# EAGLE board axiom_beta_power_board_v1.25 (EAGLE 7.7.0), part 1 of 4
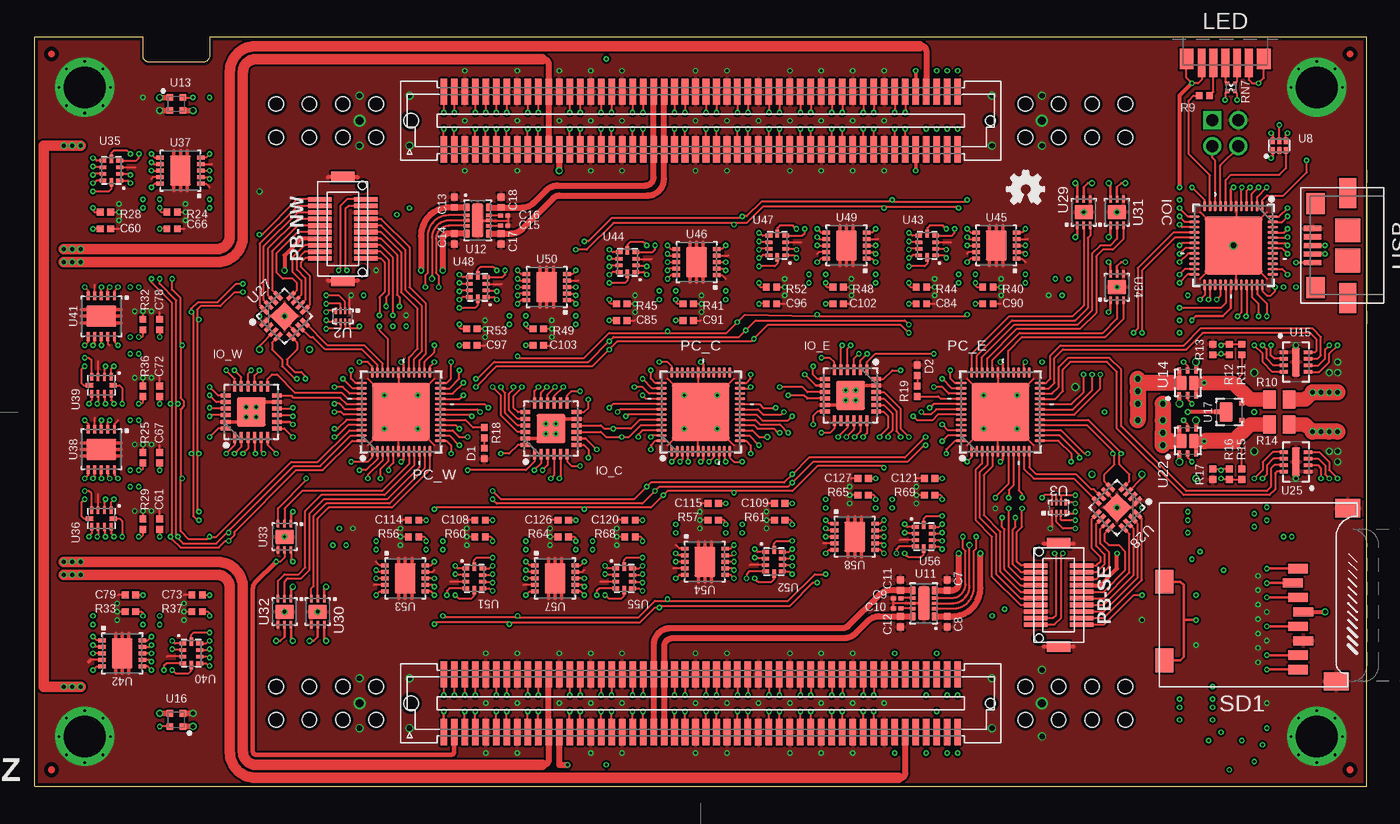
[diagram p14: board, top side]
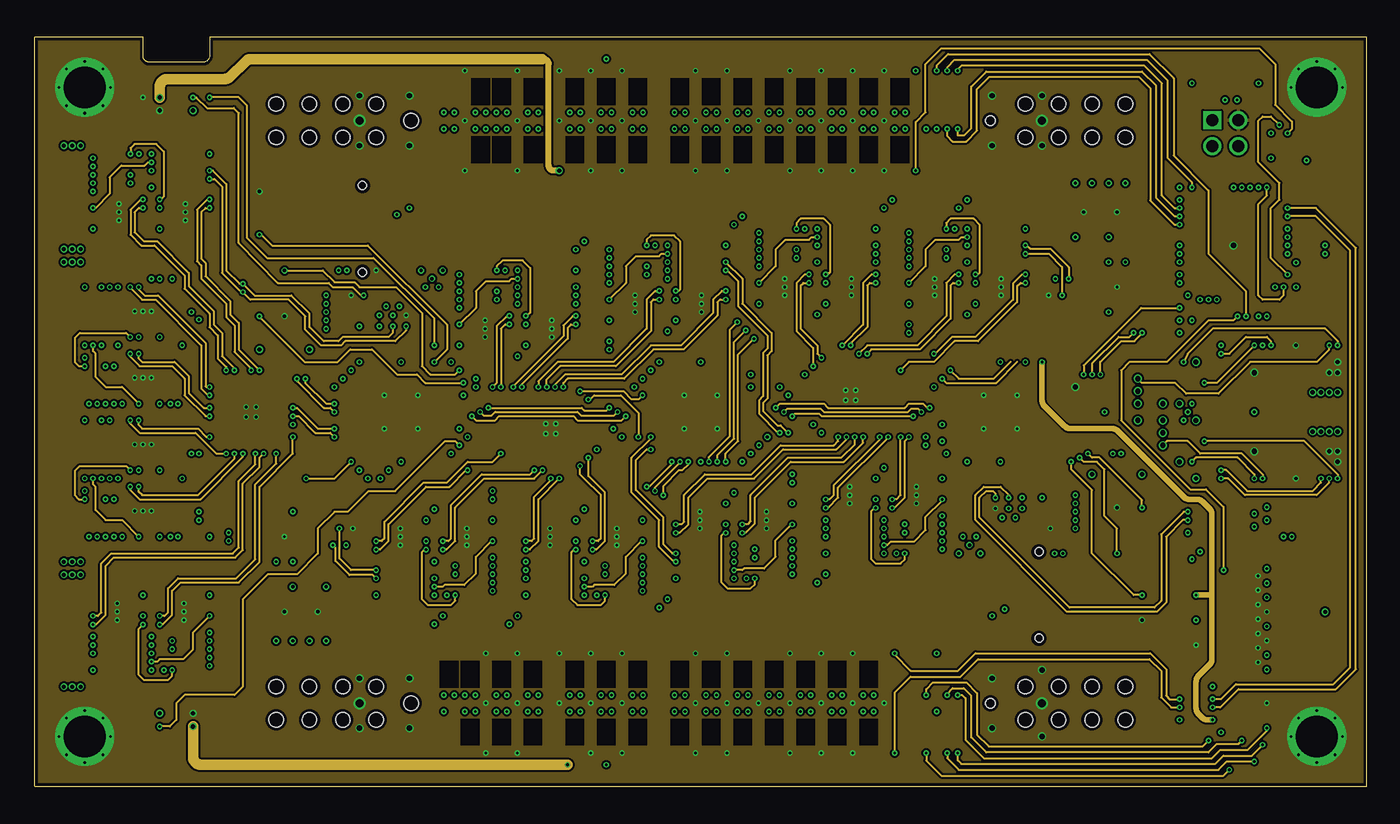
[diagram p15: board, inner layer Route2]
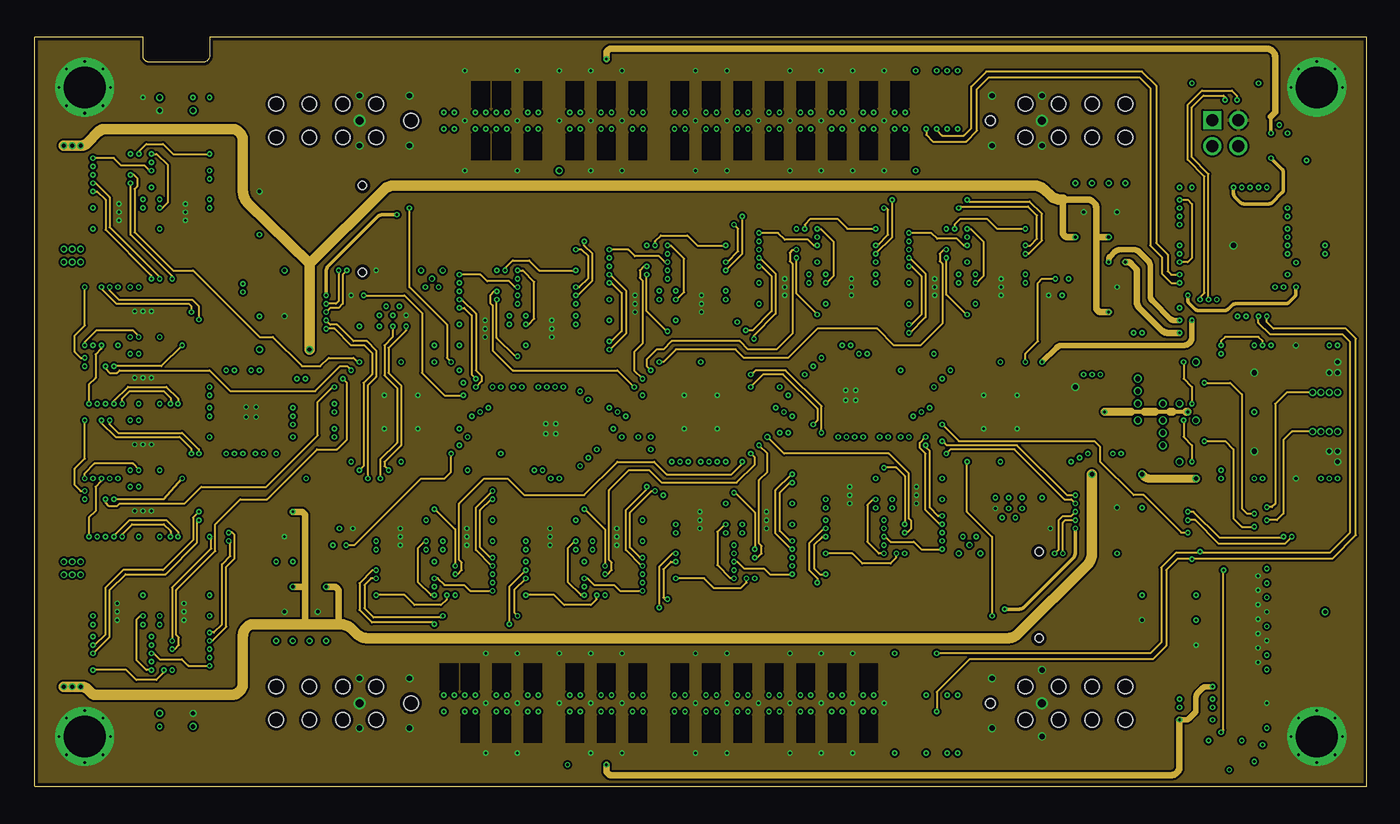
[diagram p16: board, inner layer Route15]
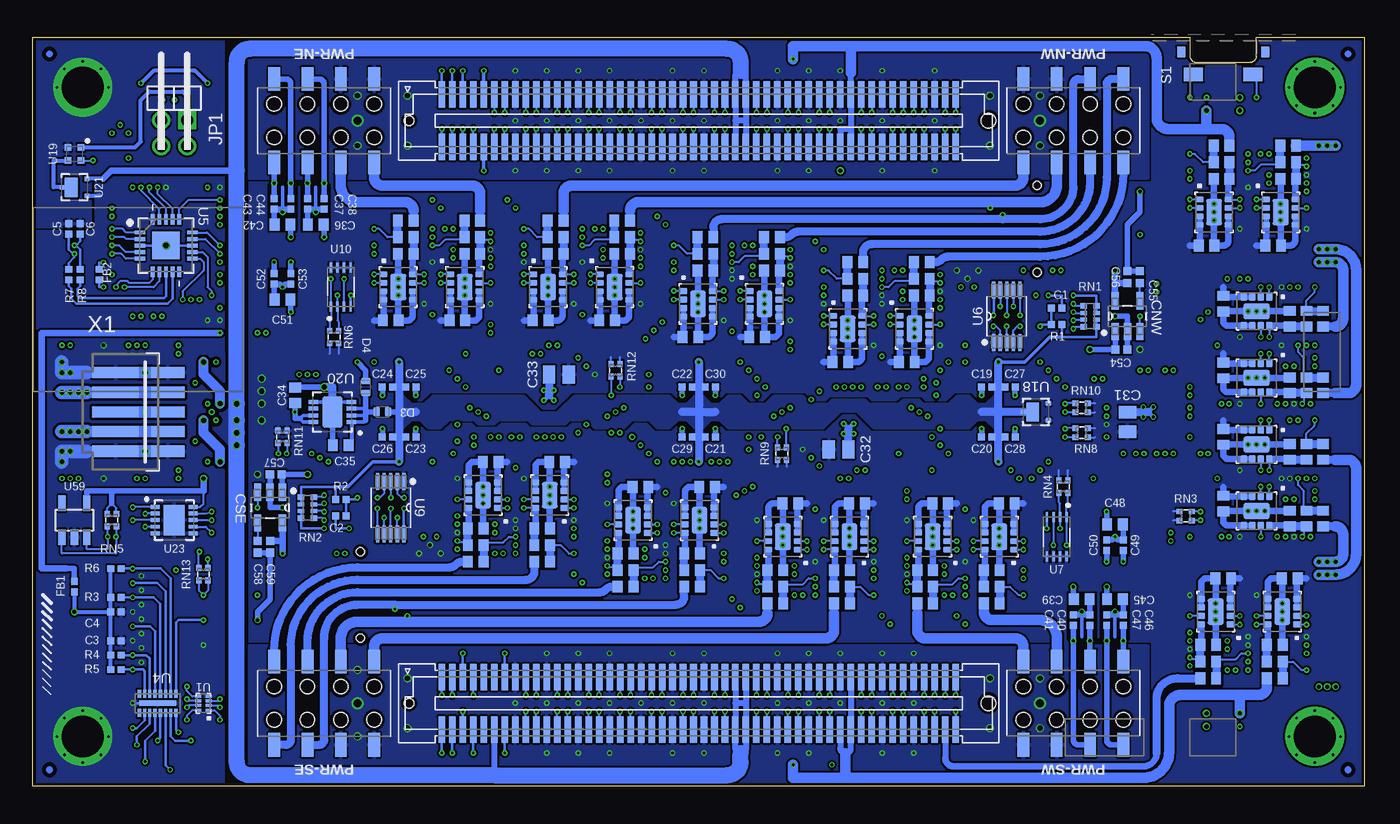
[diagram p17: board, bottom side, seen from below]

Size 101.6 x 57.15 mm. Coordinates in mm from the lower left corner, seen from the top.
Outline: 101.6,57.15 13.33,57.15 13.33,55.75 arc-90 12.83,55.25 8.76,55.25 arc-90 8.25,55.75 8.25,57.15 0,57.15 0,0 101.6,0 101.6,57.15
Copper layers (1*2*15*16): Top 0.035559375mm / dielectric 0.17018125mm / Route2 0.01778125mm / dielectric 47mil / Route15 0.01778125mm / dielectric 0.17018125mm / Bottom 0.035559375mm
Design rules "OSHPark-4layer-tuned *": minimum track width 5mil, minimum drill 8mil, track to track 6mil, track to pad 5mil, pad to pad 5mil, via to via 5mil, smd to smd 0mil, copper to edge 10mil, drill to drill 6mil, minimum pad ring 4mil, minimum via ring 4mil, stop-mask expansion 2mil, vias tented up to drill 25mil, thermal gap 6mil
Net classes: 1 LVDS: width 0.152 mm, drill 0.203 mm, clearance 0.152 mm
tKeepout: area 1.3,50.8 to 6.3,55.9; area 1.3,1.3 to 6.3,6.3; area 95.2,1.3 to 100.3,6.3; area 95.2,50.8 to 100.3,55.9
bKeepout: area 95.2,50.8 to 100.3,55.9; area 95.2,1.3 to 100.3,6.3; area 1.3,1.3 to 6.3,6.3; area 1.3,50.8 to 6.3,55.9

## Footprints (pad centres in the part's own frame; a part is rotated, then mirrored left to right if it is on the bottom)
µZ-SOCKET-NOHOLES-R = smd 0.5 x 2: 1 19.6,24.425; 2 19.6,20.027; 3 18.8,24.425; 4 18.8,20.027; 5 18,24.425; 6 18,20.027; 7 17.2,24.425; 8 17.2,20.027; 9 16.4,24.425; 10 16.4,20.027; 11 15.6,24.425; 12 15.6,20.027; 13 14.8,24.425; 14 14.8,20.027; 15 14,24.425; 16 14,20.027; 17 13.2,24.425; 18 13.2,20.027; 19 12.4,24.425; 20 12.4,20.027; 21 11.6,24.425; 22 11.6,20.027; 23 10.8,24.425; 24 10.8,20.027; 25 10,24.425; 26 10,20.027; 27 9.2,24.425; 28 9.2,20.027; 29 8.4,24.425; 30 8.4,20.027; 31 7.6,24.425; 32 7.6,20.027; 33 6.8,24.425; 34 6.8,20.027; 35 6,24.425; 36 6,20.027; 37 5.2,24.425; 38 5.2,20.027; 39 4.4,24.425; 40 4.4,20.027; 41 3.6,24.425; 42 3.6,20.027; 43 2.8,24.425; 44 2.8,20.027; 45 2,24.425; 46 2,20.027; 47 1.2,24.425; 48 1.2,20.027; 49 0.4,24.425; 50 0.4,20.027; 51 -0.4,24.425; 52 -0.4,20.027; 53 -1.2,24.425; 54 -1.2,20.027; 55 -2,24.425; 56 -2,20.027; 57 -2.8,24.425; 58 -2.8,20.027; 59 -3.6,24.425; 60 -3.6,20.027; 61 -4.4,24.425; 62 -4.4,20.027; 63 -5.2,24.425; 64 -5.2,20.027; 65 -6,24.425; 66 -6,20.027; 67 -6.8,24.425; 68 -6.8,20.027; 69 -7.6,24.425; 70 -7.6,20.027; 71 -8.4,24.425; 72 -8.4,20.027; 73 -9.2,24.425; 74 -9.2,20.027; 75 -10,24.425; 76 -10,20.027; 77 -10.8,24.425; 78 -10.8,20.027; 79 -11.6,24.425; 80 -11.6,20.027; 81 -12.4,24.425; 82 -12.4,20.027; 83 -13.2,24.425; 84 -13.2,20.027; 85 -14,24.425; 86 -14,20.027; 87 -14.8,24.425; 88 -14.8,20.027; 89 -15.6,24.425; 90 -15.6,20.027; 91 -16.4,24.425; 92 -16.4,20.027; 93 -17.2,24.425; 94 -17.2,20.027; 95 -18,24.425; 96 -18,20.027; 97 -18.8,24.425; 98 -18.8,20.027; 99 -19.6,24.425; 100 -19.6,20.027; 101 19.6,-20.025; 102 19.6,-24.425; 103 18.8,-20.027; 104 18.8,-24.425; 105 18,-20.027; 106 18,-24.425; 107 17.2,-20.027; 108 17.2,-24.425; 109 16.4,-20.027; 110 16.4,-24.425; 111 15.6,-20.027; 112 15.6,-24.425; 113 14.8,-20.027; 114 14.8,-24.425; 115 14,-20.027; 116 14,-24.425; 117 13.2,-20.027; 118 13.2,-24.425; 119 12.4,-20.027; 120 12.4,-24.425; 121 11.6,-20.027; 122 11.6,-24.425; 123 10.8,-20.027; 124 10.8,-24.425; 125 10,-20.027; 126 10,-24.425; 127 9.2,-20.027; 128 9.2,-24.425; 129 8.4,-20.027; 130 8.4,-24.425; 131 7.6,-20.027; 132 7.6,-24.425; 133 6.8,-20.027; 134 6.8,-24.425; 135 6,-20.027; 136 6,-24.425; 137 5.2,-20.027; 138 5.2,-24.425; 139 4.4,-20.027; 140 4.4,-24.425; 141 3.6,-20.027; 142 3.6,-24.425; 143 2.8,-20.027; 144 2.8,-24.425; 145 2,-20.027; 146 2,-24.425; 147 1.2,-20.027; 148 1.2,-24.425; 149 0.4,-20.027; 150 0.4,-24.425; 151 -0.4,-20.027; 152 -0.4,-24.425; 153 -1.2,-20.027; 154 -1.2,-24.425; 155 -2,-20.027; 156 -2,-24.425; 157 -2.8,-20.027; 158 -2.8,-24.425; 159 -3.6,-20.027; 160 -3.6,-24.425; 161 -4.4,-20.027; 162 -4.4,-24.425; 163 -5.2,-20.027; 164 -5.2,-24.425; 165 -6,-20.027; 166 -6,-24.425; 167 -6.8,-20.027; 168 -6.8,-24.425; 169 -7.6,-20.027; 170 -7.6,-24.425; 171 -8.4,-20.027; 172 -8.4,-24.425; 173 -9.2,-20.027; 174 -9.2,-24.425; 175 -10,-20.027; 176 -10,-24.425; 177 -10.8,-20.027; 178 -10.8,-24.425; 179 -11.6,-20.027; 180 -11.6,-24.425; 181 -12.4,-20.027; 182 -12.4,-24.425; 183 -13.2,-20.027; 184 -13.2,-24.425; 185 -14,-20.027; 186 -14,-24.425; 187 -14.8,-20.027; 188 -14.8,-24.425; 189 -15.6,-20.027; 190 -15.6,-24.425; 191 -16.4,-20.027; 192 -16.4,-24.425; 193 -17.2,-20.027; 194 -17.2,-24.425; 195 -18,-20.027; 196 -18,-24.425; 197 -18.8,-20.027; 198 -18.8,-24.425; 199 -19.6,-20.027; 200 -19.6,-24.425 | hole 0.725: 22.1,22.225; 22.1,-22.225 | hole 1.125: -22.1,22.225; -22.1,-22.225
0402-C = smd 0.52 x 0.52: 1 -0.4,0; 2 0.4,0
0201-C = smd 0.36 x 0.32: 1 -0.28,0; 2 0.28,0
0805-C = smd 0.95 x 1.35: 1 -0.75,0; 2 0.75,0
0603-C = smd 0.75 x 0.9: 1 -0.6,0; 2 0.6,0
0402-B = smd 0.62 x 0.62: 1 -0.45,0; 2 0.45,0
SOT95P280X145-5N = smd 1.321 x 0.559: 1 -1.168,0.94; 2 -1.168,0; 3 -1.168,-0.94; 4 1.168,-0.94; 5 1.168,0.94
DFN1006D-2 = smd 0.5 x 0.7: A 0.45,0; C -0.45,0
QFN50P400X400X80-25N-NSM = smd 0.813 x 0.305: 1 -1.95,1.25; 2 -1.95,0.75; 3 -1.95,0.25; 4 -1.95,-0.25; 5 -1.95,-0.75; 6 -1.95,-1.25; 13 1.95,-1.25; 14 1.95,-0.75; 15 1.95,-0.25; 16 1.95,0.25; 17 1.95,0.75; 18 1.95,1.25 | smd 0.305 x 0.813: 7 -1.25,-1.95; 8 -0.75,-1.95; 9 -0.25,-1.95; 10 0.25,-1.95; 11 0.75,-1.95; 12 1.25,-1.95; 19 1.25,1.95; 20 0.75,1.95; 21 0.25,1.95; 22 -0.25,1.95; 23 -0.75,1.95; 24 -1.25,1.95 | smd 2.2 x 2.2: 25 0,0
UQFN40P600X600X100-49N-NSM = smd 0.8 x 0.2: 1 -3,2.2; 2 -3,1.8; 3 -3,1.4; 4 -3,1; 5 -3,0.6; 6 -3,0.2; 7 -3,-0.2; 8 -3,-0.6; 9 -3,-1; 10 -3,-1.4; 11 -3,-1.8; 12 -3,-2.2; 25 3,-2.2; 26 3,-1.8; 27 3,-1.4; 28 3,-1; 29 3,-0.6; 30 3,-0.2; 31 3,0.2; 32 3,0.6; 33 3,1; 34 3,1.4; 35 3,1.8; 36 3,2.2 | smd 0.2 x 0.8: 13 -2.2,-3; 14 -1.8,-3; 15 -1.4,-3; 16 -1,-3; 17 -0.6,-3; 18 -0.2,-3; 19 0.2,-3; 20 0.6,-3; 21 1,-3; 22 1.4,-3; 23 1.8,-3; 24 2.2,-3; 37 2.2,3; 38 1.8,3; 39 1.4,3; 40 1,3; 41 0.6,3; 42 0.2,3; 43 -0.2,3; 44 -0.6,3; 45 -1,3; 46 -1.4,3; 47 -1.8,3; 48 -2.2,3 | smd 4.4 x 4.4: EP 0,0
2X02M/90-S = drill 0.914 square: 1 1,1 | drill 0.914: 2 1,-1; 3 -1,1; 4 -1,-1
MSL0104 = smd 1.06 x 1.58: 1 -2.95,-1; 7 2.95,-1 | smd 0.6 x 2.18: 2 -1.8,-1.3; 3 -0.9,-1.3; 4 0,-1.3; 5 0.9,-1.3; 6 1.8,-1.3
DF12(XX)-20DP-0.5V = smd 1.8 x 0.35: 1 -1.75,2.25; 2 1.75,2.25; 3 -1.75,1.75; 4 1.75,1.75; 5 -1.75,1.25; 6 1.75,1.25; 7 -1.75,0.75; 8 1.75,0.75; 9 -1.75,0.25; 10 1.75,0.25; 11 -1.75,-0.25; 12 1.75,-0.25; 13 -1.75,-0.75; 14 1.75,-0.75; 15 -1.75,-1.25; 16 1.75,-1.25; 17 -1.75,-1.75; 18 1.75,-1.75; 19 -1.75,-2.25; 20 1.75,-2.25 | smd 1.8 x 0.8: M1 0,3.95; M2 0,-3.95 | hole 0.625: 1.5,-3.3; 1.5,3.3
R2X04 = smd 0.9 x 1.8: 1 -3.81,3.175; 2 -3.81,-3.175; 3 -1.27,3.175; 4 -1.27,-3.175; 5 1.27,3.175; 6 1.27,-3.175; 7 3.81,3.175; 8 3.81,-3.175 | hole 1.1: -3.81,1.27; -1.27,1.27; -1.27,-1.27; -3.81,-1.27; 1.27,1.27; 1.27,-1.27; 3.81,1.27; 3.81,-1.27
4X0402ARV341 = smd 0.4 x 0.5: 1 -0.8,-0.5; 4 0.8,-0.5; 5 0.8,0.5; 8 -0.8,0.5 | smd 0.3 x 0.5: 2 -0.25,-0.5; 3 0.25,-0.5; 6 0.25,0.5; 7 -0.25,0.5
EXB24V = smd 0.4 x 0.45: 1 -0.35,-0.475; 2 0.35,-0.475; 3 0.35,0.475; 4 -0.35,0.475
EXB14V = smd 0.3 x 0.3: 1 -0.3,-0.3; 2 0.3,-0.3; 3 0.3,0.3; 4 -0.3,0.3
SKSNLAE010 = smd 1.45 x 1.05: 1 -2.275,2.575; 2 2.275,2.575 | smd 0.6 x 0.8: 3 -3.2,0.85; 4 3.2,0.85
TF-MICRO-SD_PP2 = smd 0.7 x 1.5: 1 9,-10.64; 2 7.9,-10.24; 3 6.8,-10.64; 4 5.7,-11.04; 5 4.6,-10.64; 6 3.5,-11.04; 7 2.4,-10.64; 8 1.3,-10.64 | smd 1.8 x 1.4: CD1 2,-0.44; CD2 8,-0.44 | smd 1.4 x 1.9: MT1 0.4,-13.54; MT2 13.6,-14.44
X2SON-8 = smd 0.2 x 0.52: 1 -0.525,-0.4; 2 -0.175,-0.4; 3 0.175,-0.4; 4 0.525,-0.4; 5 0.525,0.4; 6 0.175,0.4; 7 -0.175,0.4; 8 -0.525,0.4
UDFN-8 = smd 0.22 x 0.48: 1 -0.525,-0.43; 2 -0.175,-0.43; 3 0.175,-0.43; 4 0.525,-0.43; 5 0.525,0.43; 6 0.175,0.43; 7 -0.175,0.43; 8 -0.525,0.43
SON40P135X330X55-17N = smd 0.61 x 0.254: 1 -0.737,1.397; 2 -0.737,0.991; 3 -0.737,0.61; 4 -0.737,0.203; 5 -0.737,-0.203; 6 -0.737,-0.61; 7 -0.737,-0.991; 8 -0.737,-1.397; 9 0.737,-1.397; 10 0.737,-0.991; 11 0.737,-0.61; 12 0.737,-0.203; 13 0.737,0.203; 14 0.737,0.61; 15 0.737,0.991; 16 0.737,1.397 | smd 0.406 x 2.794: 17 0,0
QFN65P400X400X100-21N = smd 0.8 x 0.3: 1 -2,1; 2 -2,0.5; 3 -2,0; 4 -2,-0.5; 5 -2,-1; 11 2,-1; 12 2,-0.5; 13 2,0; 14 2,0.5; 15 2,1 | smd 0.3 x 0.8: 6 -1,-2; 7 -0.5,-2; 8 0,-2; 9 0.5,-2; 10 1,-2; 16 1,2; 17 0.5,2; 18 0,2; 19 -0.5,2; 20 -1,2 | smd 2.1 x 2.1: EP 0,0
SOP50P490X110-10N = smd 1.3 x 0.32: 1 -2,1; 2 -2,0.5; 3 -2,0; 4 -2,-0.5; 5 -2,-1; 6 2,-1; 7 2,-0.5; 8 2,0; 9 2,0.5; 10 2,1
SOT996-2/3 = smd 0.25 x 0.75: 1 -0.75,-1.5; 2 -0.25,-1.5; 3 0.25,-1.5; 4 0.75,-1.5; 5 0.75,1.5; 6 0.25,1.5; 7 -0.25,1.5; 8 -0.75,1.5
MICROPAK-6 = smd 0.3 x 0.5: 1 -0.5,-0.375; 2 0,-0.375; 3 0.5,-0.375; 4 0.5,0.375; 5 0,0.375; 6 -0.5,0.375
V-DFN3020-14 = smd 0.65 x 0.5: 1 -1,-0.85; 5 1,-0.85; 6 1,0.85; 10 -1,0.85 | smd 0.25 x 0.5: 2 -0.4,-0.85; 3 0,-0.85; 4 0.4,-0.85; 7 0.4,0.85; 8 0,0.85; 9 -0.4,0.85 | smd 2.55 x 0.9: EP 0,0
MLF-4 = smd 0.5 x 0.5: 1 -0.5,-0.5; 2 0.5,-0.5; 3 0.5,0.5; 4 -0.5,0.5
UDFN6 = smd 0.47 x 0.35: 1 -0.95,0.65; 2 -0.95,0; 3 -0.95,-0.65; 4 0.95,-0.65; 5 0.95,0; 6 0.95,0.65 | smd 1.1 x 0.75: D1 0,0.46; D2 0,-0.46
DFN8 = smd 0.25 x 0.7: 1 -0.75,-0.925; 2 -0.25,-0.925; 3 0.25,-0.925; 4 0.75,-0.925; 5 0.75,0.925; 6 0.25,0.925; 7 -0.25,0.925; 8 -0.75,0.925 | smd 2.2 x 0.6: EP 0,0
DFN2020D-3 = smd 0.45 x 0.35: 1 -0.95,0.65; 2 -0.95,-0.65; 3 0.95,0 | smd 1 x 1.5: 4 0.25,0
DFN3X3_8LEAD = smd 0.813 x 0.305: 1 -1.448,0.762; 2 -1.448,0.254; 3 -1.448,-0.254; 4 -1.448,-0.762; 5 1.448,-0.762; 6 1.448,-0.254; 7 1.448,0.254; 8 1.448,0.762 | smd 1.549 x 2.388: 9 0,0
DFN3X3_10LEAD = smd 0.7 x 0.3: 1 -1.45,1; 2 -1.45,0.5; 3 -1.45,0; 4 -1.45,-0.5; 5 -1.45,-1; 6 1.45,-1; 7 1.45,-0.5; 8 1.45,0; 9 1.45,0.5; 10 1.45,1 | smd 1.6 x 2.3: EPAD 0,0
QFN50P300X300X80-17N = smd 0.8 x 0.3: 1 -1.45,0.75; 2 -1.45,0.25; 3 -1.45,-0.25; 4 -1.45,-0.75; 9 1.45,-0.75; 10 1.45,-0.25; 11 1.45,0.25; 12 1.45,0.75 | smd 0.3 x 0.8: 5 -0.75,-1.45; 6 -0.25,-1.45; 7 0.25,-1.45; 8 0.75,-1.45; 13 0.75,1.45; 14 0.25,1.45; 15 -0.25,1.45; 16 -0.75,1.45 | smd 1.55 x 1.55: EP 0,0
DFN2018-6 = smd 0.25 x 0.55: 1 -0.5,-1; 2 0,-1; 3 0.5,-1; 4 0.5,1; 5 0,1; 6 -0.5,1 | smd 1.4 x 1.1: 10 0,0
X2QFN-10 = smd 0.3 x 0.58: 1 -0.75,-0.64; 4 0.75,-0.64; 6 0.75,0.64; 9 -0.75,0.64 | smd 0.25 x 0.58: 2 -0.25,-0.64; 3 0.25,-0.64; 7 0.25,0.64; 8 -0.25,0.64 | smd 0.64 x 0.35: 5 0.9,0; 10 -0.9,0
DFN-10 = smd 0.3 x 0.65: 1 -1,-1.55; 2 -0.5,-1.55; 3 0,-1.55; 4 0.5,-1.55; 5 1,-1.55; 6 1,1.55; 7 0.5,1.55; 8 0,1.55; 9 -0.5,1.55; 10 -1,1.55 | smd 2.3 x 1.6: EP 0,0
SOT23-5L = smd 0.55 x 1.2: 1 -0.95,-1.3; 2 0,-1.3; 3 0.95,-1.3; 4 0.95,1.3; 5 -0.95,1.3
MICROSIP = smd 0.48 x 0.58: 1 -0.975,-1.1; 2 -0.325,-1.1; 3 0.325,-1.1; 4 0.975,-1.1; 5 0.975,1.1; 6 0.325,1.1; 7 -0.325,1.1; 8 -0.975,1.1 | smd 2 x 1.2: EP 0,0
MICROSIP-DD = smd 0.48 x 0.58: 1 -0.975,-1.1; 2 -0.325,-1.1; 3 0.325,-1.1; 4 0.975,-1.1; 5 0.975,1.1; 6 0.325,1.1; 7 -0.325,1.1; 8 -0.975,1.1 | smd 2 x 1.2: EP 0,0
MICRO-AB-H-SMT = smd 0.4 x 1.35: 1 -1.3,4.125; 2 -0.65,4.125; 3 0,4.125; 4 0.65,4.125; 5 1.3,4.125 | smd 2.3 x 1.3: Z1 -4,1.45; Z4 4,1.45 | smd 1.8 x 1.9: Z2 -1.15,1.45; Z3 1.15,1.45 | smd 1.6 x 1.4: Z5 -3.2,3.9; Z6 3.2,3.9
PICO-SPOX-5 = smd 0.85 x 2.55: 1 -3,-6.5; 2 -1.5,-6.5; 3 0,-6.5; 4 1.5,-6.5; 5 3,-6.5 | smd 0.85 x 3.55: 1A -3,-2.5; 2A -1.5,-2.5; 3A 0,-2.5; 4A 1.5,-2.5; 5A 3,-2.5
µZ-CONONLY = smd 0.5 x 2: 1 19.6,-24.226; 2 19.6,-20.226; 3 18.8,-24.226; 4 18.8,-20.226; 5 18,-24.226; 6 18,-20.226; 7 17.2,-24.226; 8 17.2,-20.226; 9 16.4,-24.226; 10 16.4,-20.226; 11 15.6,-24.226; 12 15.6,-20.226; 13 14.8,-24.226; 14 14.8,-20.226; 15 14,-24.226; 16 14,-20.226; 17 13.2,-24.226; 18 13.2,-20.226; 19 12.4,-24.226; 20 12.4,-20.226; 21 11.6,-24.226; 22 11.6,-20.226; 23 10.8,-24.226; 24 10.8,-20.226; 25 10,-24.226; 26 10,-20.226; 27 9.2,-24.226; 28 9.2,-20.226; 29 8.4,-24.226; 30 8.4,-20.226; 31 7.6,-24.226; 32 7.6,-20.226; 33 6.8,-24.226; 34 6.8,-20.226; 35 6,-24.226; 36 6,-20.226; 37 5.2,-24.226; 38 5.2,-20.226; 39 4.4,-24.226; 40 4.4,-20.226; 41 3.6,-24.226; 42 3.6,-20.226; 43 2.8,-24.226; 44 2.8,-20.226; 45 2,-24.226; 46 2,-20.226; 47 1.2,-24.226; 48 1.2,-20.226; 49 0.4,-24.226; 50 0.4,-20.226; 51 -0.4,-24.226; 52 -0.4,-20.226; 53 -1.2,-24.226; 54 -1.2,-20.226; 55 -2,-24.226; 56 -2,-20.226; 57 -2.8,-24.226; 58 -2.8,-20.226; 59 -3.6,-24.226; 60 -3.6,-20.226; 61 -4.4,-24.226; 62 -4.4,-20.226; 63 -5.2,-24.226; 64 -5.2,-20.226; 65 -6,-24.226; 66 -6,-20.226; 67 -6.8,-24.226; 68 -6.8,-20.226; 69 -7.6,-24.226; 70 -7.6,-20.226; 71 -8.4,-24.226; 72 -8.4,-20.226; 73 -9.2,-24.226; 74 -9.2,-20.226; 75 -10,-24.226; 76 -10,-20.226; 77 -10.8,-24.226; 78 -10.8,-20.226; 79 -11.6,-24.226; 80 -11.6,-20.226; 81 -12.4,-24.226; 82 -12.4,-20.226; 83 -13.2,-24.226; 84 -13.2,-20.226; 85 -14,-24.226; 86 -14,-20.226; 87 -14.8,-24.226; 88 -14.8,-20.226; 89 -15.6,-24.226; 90 -15.6,-20.226; 91 -16.4,-24.226; 92 -16.4,-20.226; 93 -17.2,-24.226; 94 -17.2,-20.226; 95 -18,-24.226; 96 -18,-20.226; 97 -18.8,-24.226; 98 -18.8,-20.226; 99 -19.6,-24.226; 100 -19.6,-20.226; 101 19.6,20.226; 102 19.6,24.226; 103 18.8,20.226; 104 18.8,24.226; 105 18,20.226; 106 18,24.226; 107 17.2,20.226; 108 17.2,24.226; 109 16.4,20.226; 110 16.4,24.226; 111 15.6,20.226; 112 15.6,24.226; 113 14.8,20.226; 114 14.8,24.226; 115 14,20.226; 116 14,24.226; 117 13.2,20.226; 118 13.2,24.226; 119 12.4,20.226; 120 12.4,24.226; 121 11.6,20.226; 122 11.6,24.226; 123 10.8,20.226; 124 10.8,24.226; 125 10,20.226; 126 10,24.226; 127 9.2,20.226; 128 9.2,24.226; 129 8.4,20.226; 130 8.4,24.226; 131 7.6,20.226; 132 7.6,24.226; 133 6.8,20.226; 134 6.8,24.226; 135 6,20.226; 136 6,24.226; 137 5.2,20.226; 138 5.2,24.226; 139 4.4,20.226; 140 4.4,24.226; 141 3.6,20.226; 142 3.6,24.226; 143 2.8,20.226; 144 2.8,24.226; 145 2,20.226; 146 2,24.226; 147 1.2,20.226; 148 1.2,24.226; 149 0.4,20.226; 150 0.4,24.226; 151 -0.4,20.226; 152 -0.4,24.226; 153 -1.2,20.226; 154 -1.2,24.226; 155 -2,20.226; 156 -2,24.226; 157 -2.8,20.226; 158 -2.8,24.226; 159 -3.6,20.226; 160 -3.6,24.226; 161 -4.4,20.226; 162 -4.4,24.226; 163 -5.2,20.226; 164 -5.2,24.226; 165 -6,20.226; 166 -6,24.226; 167 -6.8,20.226; 168 -6.8,24.226; 169 -7.6,20.226; 170 -7.6,24.226; 171 -8.4,20.226; 172 -8.4,24.226; 173 -9.2,20.226; 174 -9.2,24.226; 175 -10,20.226; 176 -10,24.226; 177 -10.8,20.226; 178 -10.8,24.226; 179 -11.6,20.226; 180 -11.6,24.226; 181 -12.4,20.226; 182 -12.4,24.226; 183 -13.2,20.226; 184 -13.2,24.226; 185 -14,20.226; 186 -14,24.226; 187 -14.8,20.226; 188 -14.8,24.226; 189 -15.6,20.226; 190 -15.6,24.226; 191 -16.4,20.226; 192 -16.4,24.226; 193 -17.2,20.226; 194 -17.2,24.226; 195 -18,20.226; 196 -18,24.226; 197 -18.8,20.226; 198 -18.8,24.226; 199 -19.6,20.226; 200 -19.6,24.226 | hole 1.125: -22.1,-22.225; -22.1,22.225 | hole 0.725: 22.1,-22.225; 22.1,22.225

## Placement (x,y rotation side)
BETA  µZ-FCI-SOCKET-NOHOLES-R  [µZ-SOCKET-NOHOLES-R]  50.8,28.57 0 top
C1  10n  [0402-C]  23.49,36.51 0 bottom
C2  10n  [0402-C]  78.1,20.64 180 bottom
C3  1u  [0402-C]  95.25,11.12 0 bottom
C4  100n  [0402-C]  95.25,13.32 0 bottom
C5  [0402-C]  98.87,42.55 90 bottom
C6  [0402-C]  97.98,42.55 90 bottom
C7  [0402-C]  69.6,15.37 90 top
C8  [0402-C]  69.6,12.57 270 top
C9  [0201-C]  65.79,14.35 180 top
C10  [0201-C]  65.79,13.59 180 top
C11  [0402-C]  66.04,15.37 90 top
C12  [0402-C]  66.04,12.57 270 top
C13  [0402-C]  32,44.58 90 top
C14  [0402-C]  32,41.78 270 top
C15  [0201-C]  35.81,42.8 0 top
C16  [0201-C]  35.81,43.56 0 top
C17  [0402-C]  35.56,41.78 270 top
C18  [0402-C]  35.56,44.58 90 top
C19  100n  [0402-C]  28.83,30.48 180 bottom
C20  100n  [0402-C]  28.83,26.67 180 bottom
C21  100n  [0402-C]  49.91,26.67 0 bottom
C22  100n  [0402-C]  51.69,30.48 180 bottom
C23  100n  [0402-C]  72.77,26.67 0 bottom
C24  100n  [0402-C]  74.55,30.48 180 bottom
C25  4u7  [0402-C]  72.77,30.48 0 bottom
C26  4u7  [0402-C]  74.55,26.67 180 bottom
C27  4u7  [0402-C]  27.05,30.48 0 bottom
C28  4u7  [0402-C]  27.05,26.67 0 bottom
C29  4u7  [0402-C]  51.69,26.67 180 bottom
C30  4u7  [0402-C]  49.91,30.48 0 bottom
C31  47u  [0805-C]  18.1,27.81 90 bottom
C32  47u  [0805-C]  40.13,25.72 0 bottom
C33  47u  [0805-C]  61.47,31.43 180 bottom
C34  10u  [0603-C]  81.6,29.84 90 bottom
C35  10u  [0603-C]  78.1,26.04 180 bottom
C36  4u7  [0603-C]  80.01,42.86 180 bottom
C37  1u  [0402-C]  80.64,44.45 270 bottom
C38  1u  [0402-C]  79.38,44.45 270 bottom
C39  4u7  [0603-C]  21.59,14.29 0 bottom
C40  1u  [0402-C]  20.95,12.7 90 bottom
C41  1u  [0402-C]  22.22,12.7 90 bottom
C42  4u7  [0603-C]  82.55,42.86 180 bottom
C43  1u  [0402-C]  83.19,44.45 270 bottom
C44  1u  [0402-C]  81.91,44.45 270 bottom
C45  4u7  [0603-C]  19.05,14.29 0 bottom
C46  1u  [0402-C]  18.41,12.7 90 bottom
C47  1u  [0402-C]  19.68,12.7 90 bottom
C48  4u7  [0603-C]  19.05,20 0 bottom
C49  1u  [0402-C]  18.41,18.41 90 bottom
C50  1u  [0402-C]  19.68,18.41 90 bottom
C51  4u7  [0603-C]  82.55,37.15 180 bottom
C52  1u  [0402-C]  83.19,38.73 270 bottom
C53  1u  [0402-C]  81.91,38.73 270 bottom
C54  1u  [0402-B]  18.57,33.34 0 bottom
C55  10n  [0402-B]  17.14,38.86 90 bottom
C56  1u  [0402-B]  18.1,38.86 90 bottom
C57  1u  [0402-B]  83.06,23.81 180 bottom
C58  10n  [0402-B]  84.45,18.29 270 bottom
C59  1u  [0402-B]  83.5,18.29 270 bottom
C60  [0402-C]  5.4,42.55 0 top
C61  [0402-C]  9.52,20 90 top
C62  [0603-C]  12.06,41.27 0 bottom
C63  [0603-C]  10.92,46.36 180 bottom
C64  [0603-C]  10.79,26.67 270 bottom
C65  [0603-C]  5.71,25.53 90 bottom
C66  [0402-C]  10.48,42.55 0 top
C67  [0402-C]  9.52,25.08 90 top
C68  [0603-C]  6.98,41.27 0 bottom
C69  [0603-C]  5.84,46.36 180 bottom
C70  [0603-C]  10.79,21.59 270 bottom
C71  [0603-C]  5.71,20.45 90 bottom
C72  [0402-C]  9.52,30.16 90 top
C73  [0402-C]  12.38,14.6 180 top
C74  [0603-C]  10.79,36.83 270 bottom
C75  [0603-C]  5.71,35.69 90 bottom
C76  [0603-C]  5.71,15.88 180 bottom
C77  [0603-C]  6.86,10.79 0 bottom
C78  [0402-C]  9.52,35.24 90 top
C79  [0402-C]  7.3,14.6 180 top
C80  [0603-C]  10.79,31.75 270 bottom
C81  [0603-C]  5.71,30.61 90 bottom
C82  [0603-C]  10.79,15.88 180 bottom
C83  [0603-C]  11.94,10.79 0 bottom
C84  [0402-C]  67.63,36.83 0 top
C85  [0402-C]  44.77,35.56 0 top
C86  [0603-C]  74.3,35.56 0 bottom
C87  [0603-C]  73.15,40.64 180 bottom
C88  [0603-C]  51.43,34.29 0 bottom
C89  [0603-C]  50.29,39.37 180 bottom
C90  [0402-C]  72.71,36.83 0 top
C91  [0402-C]  49.85,35.56 0 top
C92  [0603-C]  69.22,35.56 0 bottom
C93  [0603-C]  68.07,40.64 180 bottom
C94  [0603-C]  46.35,34.29 0 bottom
C95  [0603-C]  45.21,39.37 180 bottom
C96  [0402-C]  56.2,36.83 0 top
C97  [0402-C]  33.34,33.66 0 top
C98  [0603-C]  62.86,35.56 0 bottom
C99  [0603-C]  61.72,40.64 180 bottom
C100  [0603-C]  40,32.38 0 bottom
C101  [0603-C]  38.86,37.47 180 bottom
C102  [0402-C]  61.28,36.83 0 top
C103  [0402-C]  38.42,33.66 0 top
C104  [0603-C]  57.78,35.56 0 bottom
C105  [0603-C]  56.64,40.64 180 bottom
C106  [0603-C]  34.92,32.38 0 bottom
C107  [0603-C]  33.78,37.47 180 bottom
C108  [0402-C]  33.97,20.32 180 top
C109  [0402-C]  56.83,21.59 180 top
C110  [0603-C]  27.3,21.59 180 bottom
C111  [0603-C]  28.45,16.51 0 bottom
C112  [0603-C]  50.16,22.86 180 bottom
C113  [0603-C]  51.31,17.78 0 bottom
C114  [0402-C]  28.89,20.32 180 top
C115  [0402-C]  51.75,21.59 180 top
C116  [0603-C]  32.38,21.59 180 bottom
C117  [0603-C]  33.53,16.51 0 bottom
C118  [0603-C]  55.24,22.86 180 bottom
C119  [0603-C]  56.39,17.78 0 bottom
C120  [0402-C]  45.4,20.32 180 top
C121  [0402-C]  68.26,23.49 180 top
C122  [0603-C]  38.73,21.59 180 bottom
C123  [0603-C]  39.88,16.51 0 bottom
C124  [0603-C]  61.59,24.77 180 bottom
C125  [0603-C]  62.74,19.68 0 bottom
C126  [0402-C]  40.32,20.32 180 top
C127  [0402-C]  63.18,23.49 180 top
C128  [0603-C]  43.81,21.59 180 bottom
C129  [0603-C]  44.96,16.51 0 bottom
C130  [0603-C]  66.67,24.77 180 bottom
C131  [0603-C]  67.82,19.68 0 bottom
CNW  SPX3819M5-L  [SOT95P280X145-5N]  18.1,35.88 90 bottom
CSE  SPX3819M5-L  [SOT95P280X145-5N]  83.5,21.27 270 bottom
D1  [0402-C]  34.29,25.4 270 top
D2  [0402-C]  67.31,31.75 90 top
D3  PMEG2010BELD  [DFN1006D-2]  74.93,28.57 180 bottom
D4  PMEG2010BELD  [DFN1006D-2]  76.2,30.48 270 bottom
F1  FIDUCIAL  [FID_ARROW]  1.27,55.88 0 top
F2  FIDUCIAL  [FID_ARROW]  100.33,55.88 0 top
F3  FIDUCIAL  [FID_ARROW]  100.33,1.27 0 top
F4  FIDUCIAL  [FID_ARROW]  1.27,1.27 0 top
F5  FIDUCIAL  [FID_ARROW]  100.33,55.88 0 bottom
F6  FIDUCIAL  [FID_ARROW]  1.27,55.88 0 bottom
F7  FIDUCIAL  [FID_ARROW]  1.27,1.27 0 bottom
F8  FIDUCIAL  [FID_ARROW]  100.33,1.27 0 bottom
FB1  [0402-C]  98.42,15.24 270 bottom
FB2  [0402-C]  96.52,39.05 90 bottom
FB3  [0603-C]  10.92,48.89 0 bottom
FB4  [0603-C]  3.17,25.53 270 bottom
FB5  [0603-C]  5.84,48.89 0 bottom
FB6  [0603-C]  3.17,20.45 270 bottom
FB7  [0603-C]  3.17,35.69 270 bottom
FB8  [0603-C]  6.86,8.25 180 bottom
FB9  [0603-C]  3.17,30.61 270 bottom
FB10  [0603-C]  11.94,8.25 180 bottom
FB11  [0603-C]  73.15,43.18 0 bottom
FB12  [0603-C]  50.29,41.91 0 bottom
FB13  [0603-C]  68.07,43.18 0 bottom
FB14  [0603-C]  45.21,41.91 0 bottom
FB15  [0603-C]  61.72,43.18 0 bottom
FB16  [0603-C]  38.86,40 0 bottom
FB17  [0603-C]  56.64,43.18 0 bottom
FB18  [0603-C]  33.78,40 0 bottom
FB19  [0603-C]  28.45,13.97 180 bottom
FB20  [0603-C]  51.31,15.24 180 bottom
FB21  [0603-C]  33.53,13.97 180 bottom
FB22  [0603-C]  56.39,15.24 180 bottom
FB23  [0603-C]  39.88,13.97 180 bottom
FB24  [0603-C]  62.74,17.14 180 bottom
FB25  [0603-C]  44.96,13.97 180 bottom
FB26  [0603-C]  67.82,17.14 180 bottom
IO_C  MCP23018  [QFN50P400X400X80-25N-NSM]  39.37,27.3 90 top
IO_E  MCP23018  [QFN50P400X400X80-25N-NSM]  62.23,29.84 270 top
IO_W  MCP23018  [QFN50P400X400X80-25N-NSM]  16.51,28.57 90 top
IOC  PIC16F15386  [UQFN40P600X600X100-49N-NSM]  91.44,41.27 270 top
JP1  [2X02M/90-S]  90.81,49.85 0 bottom
LED  MSL0104RGB  [MSL0104]  90.81,56.52 0 top
LOGO2  OSHW_LOGO_FILLX0100-NT  [OSHW_FILLX100_NOTEXT]  74.17,44.45 0 top
PB-NW  DF12(XX)-20DP-0.5V  [DF12(XX)-20DP-0.5V]  23.49,42.55 0 top
PB-SE  DF12(XX)-20DP-0.5V  [DF12(XX)-20DP-0.5V]  78.1,14.6 180 top
PC_C  PIC16F15386  [UQFN40P600X600X100-49N-NSM]  50.8,28.57 90 top
PC_E  PIC16F15386  [UQFN40P600X600X100-49N-NSM]  73.66,28.57 90 top
PC_W  PIC16F15386  [UQFN40P600X600X100-49N-NSM]  27.94,28.57 90 top
PWR-NE  PINRC-2X04  [R2X04]  79.38,50.8 180 bottom
PWR-NW  PINRC-2X04  [R2X04]  22.22,50.8 0 bottom
PWR-SE  PINRC-2X04  [R2X04]  79.38,6.35 180 bottom
PWR-SW  PINRC-2X04  [R2X04]  22.22,6.35 0 bottom
R1  200k  [0402-C]  23.49,35.24 180 bottom
R2  200k  [0402-C]  78.1,21.91 0 bottom
R3  50k  [0402-C]  95.25,14.42 0 bottom
R4  50k  [0402-C]  95.25,10.02 0 bottom
R5  50k  [0402-C]  95.25,8.92 0 bottom
R6  50k  [0402-C]  95.25,16.62 0 bottom
R7  [0402-C]  98.87,39.05 270 bottom
R8  [0402-C]  97.98,39.05 270 bottom
R9  [0402-C]  89.22,52.7 180 top
R10  [0805-C]  94.93,29.53 180 top
R11  [0402-C]  92.07,33.34 90 top
R12  [0402-C]  91.12,33.34 270 top
R13  [0402-C]  89.85,33.34 90 top
R14  [0805-C]  94.93,27.62 180 top
R15  [0402-C]  92.07,23.81 270 top
R16  [0402-C]  91.12,23.81 90 top
R17  [0402-C]  89.85,23.81 270 top
R18  [0402-C]  34.29,26.99 270 top
R19  [0402-C]  67.31,30.16 90 top
R22  [0603-C]  10.92,47.62 180 bottom
R23  [0603-C]  4.45,25.53 90 bottom
R24  [0402-C]  10.48,43.81 180 top
R25  [0402-C]  8.25,25.08 270 top
R26  [0603-C]  5.84,47.62 180 bottom
R27  [0603-C]  4.45,20.45 90 bottom
R28  [0402-C]  5.4,43.81 180 top
R29  [0402-C]  8.25,20 270 top
R30  [0603-C]  4.45,35.69 90 bottom
R31  [0603-C]  6.86,9.52 0 bottom
R32  [0402-C]  8.25,35.24 270 top
R33  [0402-C]  7.3,13.33 0 top
R34  [0603-C]  4.45,30.61 90 bottom
R35  [0603-C]  11.94,9.52 0 bottom
R36  [0402-C]  8.25,30.16 270 top
R37  [0402-C]  12.38,13.33 0 top
R38  [0603-C]  73.15,41.91 180 bottom
R39  [0603-C]  50.29,40.64 180 bottom
R40  [0402-C]  72.71,38.1 180 top
R41  [0402-C]  49.85,36.83 180 top
R42  [0603-C]  68.07,41.91 180 bottom
R43  [0603-C]  45.21,40.64 180 bottom
R44  [0402-C]  67.63,38.1 180 top
R45  [0402-C]  44.77,36.83 180 top
R46  [0603-C]  61.72,41.91 180 bottom
R47  [0603-C]  38.86,38.73 180 bottom
R48  [0402-C]  61.28,38.1 180 top
R49  [0402-C]  38.42,34.92 180 top
R50  [0603-C]  56.64,41.91 180 bottom
R51  [0603-C]  33.78,38.73 180 bottom
R52  [0402-C]  56.2,38.1 180 top
R53  [0402-C]  33.34,34.92 180 top
R54  [0603-C]  28.45,15.24 0 bottom
R55  [0603-C]  51.31,16.51 0 bottom
R56  [0402-C]  28.89,19.05 0 top
R57  [0402-C]  51.75,20.32 0 top
R58  [0603-C]  33.53,15.24 0 bottom
R59  [0603-C]  56.39,16.51 0 bottom
R60  [0402-C]  33.97,19.05 0 top
R61  [0402-C]  56.83,20.32 0 top
R62  [0603-C]  39.88,15.24 0 bottom
R63  [0603-C]  62.74,18.41 0 bottom
R64  [0402-C]  40.32,19.05 0 top
R65  [0402-C]  63.18,22.23 0 top
R66  [0603-C]  44.96,15.24 0 bottom
R67  [0603-C]  67.82,18.41 0 bottom
R68  [0402-C]  45.4,19.05 0 top
R69  [0402-C]  68.26,22.23 0 top
RN1  [4X0402ARV341]  20.95,35.88 270 bottom
RN2  [4X0402ARV341]  80.64,21.27 90 bottom
RN3  [EXB24V]  13.65,20.64 90 bottom
RN4  [EXB24V]  22.99,22.86 0 bottom
RN5  [EXB24V]  95.57,20.32 0 bottom
RN6  [EXB24V]  78.61,34.29 180 bottom
RN7  [EXB14V]  91.25,53.34 0 top
RN8  [EXB24V]  21.59,26.99 270 bottom
RN9  [EXB24V]  44.45,25.4 180 bottom
RN10  [EXB24V]  21.59,28.89 270 bottom
RN11  [EXB24V]  82.55,26.67 0 bottom
RN12  [EXB24V]  57.15,31.75 0 bottom
RN13  [EXB24V]  88.58,16.19 180 bottom
S1  SKSNLAE010  [SKSNLAE010]  10.79,56.9 180 bottom
SD1  MICRO-SD-2CD  [TF-MICRO-SD_PP2]  85.72,7.62 90 top
U1  TXS0102  [X2SON-8]  88.58,6.35 90 bottom
U2  PCA9306  [UDFN-8]  23.49,35.88 180 top
U3  PCA9306  [UDFN-8]  78.1,21.27 0 top
U4  IP4251CZ16-8-TTL  [SON40P135X330X55-17N]  92.07,6.35 270 bottom
U5  FT231  [QFN65P400X400X100-21N]  91.44,41.27 0 bottom
U6  MCP4728-E/UN  [SOP50P490X110-10N]  27.3,35.88 90 bottom
U7  LM75BGD  [SOT996-2/3]  23.49,19.05 180 bottom
U8  FXLH1T45  [MICROPAK-6]  94.93,48.89 0 top
U9  MCP4728-E/UN  [SOP50P490X110-10N]  74.3,21.27 270 bottom
U10  LM75BGD  [SOT996-2/3]  78.1,38.1 0 bottom
U11  AP22966  [V-DFN3020-14]  67.82,13.97 90 top
U12  AP22966  [V-DFN3020-14]  33.78,43.18 270 top
U13  MIC94040  [MLF-4]  10.79,52.07 270 top
U14  NTLUD4C26N  [UDFN6]  87.95,30.8 90 top
U15  LTC4365  [DFN8]  96.2,32.38 270 top
U16  MIC94040  [MLF-4]  10.79,5.08 90 top
U17  PMEG2020CPAS  [DFN2020D-3]  91.12,28.57 180 top
U18  PMEG2020CPAS  [DFN2020D-3]  25.08,28.57 180 bottom
U19  MIC94040  [MLF-4]  98.42,48.26 180 bottom
U20  LT1965  [DFN3X3_8LEAD]  78.74,28.57 180 bottom
U21  PMEG2020CPAS  [DFN2020D-3]  98.42,45.72 180 bottom
U22  NTLUD4C26N  [UDFN6]  87.95,26.35 90 top
U23  PAC1720  [DFN3X3_10LEAD]  90.81,20.32 0 bottom
U25  LTC4365  [DFN8]  96.2,24.77 90 top
U27  MCP23009  [QFN50P300X300X80-17N]  19.05,35.88 45 top
U28  MCP23009  [QFN50P300X300X80-17N]  82.55,21.27 225 top
U29  AP7312-3333W6-7  [DFN2018-6]  80.01,43.81 0 top
U30  AP7312-3333W6-7  [DFN2018-6]  21.59,13.33 180 top
U31  AP7312-3333W6-7  [DFN2018-6]  82.55,43.81 0 top
U32  AP7312-3333W6-7  [DFN2018-6]  19.05,13.33 180 top
U33  AP7312-3333W6-7  [DFN2018-6]  19.05,19.05 180 top
U34  AP7312-3333W6-7  [DFN2018-6]  82.55,38.1 0 top
U35  ADS1018  [X2QFN-10]  5.84,46.99 90 top
U36  ADS1018  [X2QFN-10]  5.08,20.45 180 top
U37  MCP46X2  [DFN-10]  11.11,46.99 90 top
U38  MCP46X2  [DFN-10]  5.08,25.72 180 top
U39  ADS1018  [X2QFN-10]  5.08,30.61 180 top
U40  ADS1018  [X2QFN-10]  11.94,10.16 270 top
U41  MCP46X2  [DFN-10]  5.08,35.88 180 top
U42  MCP46X2  [DFN-10]  6.67,10.16 270 top
U43  ADS1018  [X2QFN-10]  68.07,41.27 90 top
U44  ADS1018  [X2QFN-10]  45.21,40 90 top
U45  MCP46X2  [DFN-10]  73.34,41.27 90 top
U46  MCP46X2  [DFN-10]  50.48,40 90 top
U47  ADS1018  [X2QFN-10]  56.64,41.27 90 top
U48  ADS1018  [X2QFN-10]  33.78,38.1 90 top
U49  MCP46X2  [DFN-10]  61.91,41.27 90 top
U50  MCP46X2  [DFN-10]  39.05,38.1 90 top
U51  ADS1018  [X2QFN-10]  33.53,15.88 270 top
U52  ADS1018  [X2QFN-10]  56.39,17.14 270 top
U53  MCP46X2  [DFN-10]  28.26,15.88 270 top
U54  MCP46X2  [DFN-10]  51.12,17.14 270 top
U55  ADS1018  [X2QFN-10]  44.96,15.88 270 top
U56  ADS1018  [X2QFN-10]  67.82,19.05 270 top
U57  MCP46X2  [DFN-10]  39.69,15.88 270 top
U58  MCP46X2  [DFN-10]  62.55,19.05 270 top
U59  24AA00OT  [SOT23-5L]  98.42,20.32 0 bottom
U_I  TPS82085  [MICROSIP]  73.72,38.1 270 bottom
U_J  TPS82085DD  [MICROSIP-DD]  68.64,38.1 270 bottom
U_K  TPS82085  [MICROSIP]  62.29,38.1 270 bottom
U_L  TPS82085DD  [MICROSIP-DD]  57.21,38.1 270 bottom
U_M  TPS82085  [MICROSIP]  50.86,36.83 270 bottom
U_N  TPS82085DD  [MICROSIP-DD]  45.78,36.83 270 bottom
U_O  TPS82085  [MICROSIP]  39.43,34.92 270 bottom
U_P  TPS82085DD  [MICROSIP-DD]  34.35,34.92 270 bottom
U_Q  TPS82085  [MICROSIP]  27.88,19.05 90 bottom
U_R  TPS82085DD  [MICROSIP-DD]  32.96,19.05 90 bottom
U_S  TPS82085  [MICROSIP]  39.31,19.05 90 bottom
U_T  TPS82085DD  [MICROSIP-DD]  44.39,19.05 90 bottom
U_U  TPS82085  [MICROSIP]  50.74,20.32 90 bottom
U_V  TPS82085DD  [MICROSIP-DD]  55.82,20.32 90 bottom
U_W  TPS82085  [MICROSIP]  62.17,22.23 90 bottom
U_X  TPS82085DD  [MICROSIP-DD]  67.25,22.23 90 bottom
UA  TPS82085  [MICROSIP]  11.49,43.81 270 bottom
UB  TPS82085DD  [MICROSIP-DD]  6.41,43.81 270 bottom
UC  TPS82085  [MICROSIP]  8.25,36.26 180 bottom
UD  TPS82085DD  [MICROSIP-DD]  8.25,31.18 180 bottom
UE  TPS82085  [MICROSIP]  8.25,26.1 180 bottom
UF  TPS82085DD  [MICROSIP-DD]  8.25,21.02 180 bottom
UG  TPS82085  [MICROSIP]  6.29,13.33 90 bottom
UH  TPS82085DD  [MICROSIP-DD]  11.37,13.33 90 bottom
USB  5_USB_3S  [MICRO-AB-H-SMT]  101.6,41.27 90 top
X1  PICO-SPOX-5  [PICO-SPOX-5]  97.79,28.57 90 bottom
ZED  µZ-FCI-CONONLY  [µZ-CONONLY]  50.8,28.57 180 bottom

## Tracks (layer width: path | path; a pad name or v marks a point on that pad's centre or on a via)
!ALERT  (via drill 0.2)
  Top 0.152: PC_E.46 69.66,27.18 v69.22,27.62
  Route15 0.152: v69.22,27.62 70.48,26.35 80.83,26.35 81.28,25.91 81.28,24.77 83.82,22.23 84.58,22.23 87.44,19.37 v87.95,19.37
  Bottom 0.152: U23.7 88.4,19.82 v87.95,19.37
!CS0  (via drill 0.2)
  Top 0.152: U35.2 7.23,46.74 v7.3,46.67 | PC_W.36 25.74,32.05 25.4,32.38 v24.76,32.38
  Route15 0.152: v7.3,46.67 7.56,46.67 7.81,46.42 7.81,45.78 7.62,45.59 7.62,42.29 10.54,39.37 12.06,39.37 17.14,34.29 18.16,34.29 20.38,32.07 21.78,32.07 22.42,32.7 24.32,32.7 24.64,32.38 v24.76,32.38
!CS1  (via drill 0.2)
  Top 0.152: U39.2 5.33,32 v5.4,32.07 | PC_W.37 24.47,30.77 24.13,31.11 v24.13,31.75
  Route15 0.152: v5.4,32.07 5.4,31.88 5.71,31.56 6.29,31.56 6.48,31.75 13.33,31.75 14.92,30.16 21.4,30.16 23.3,32.07 23.81,32.07 v24.13,31.75
!CS2  (via drill 0.2)
  Top 0.152: U36.2 5.33,21.84 v5.4,21.91 | PC_W.39 24,29.97 23.49,30.48 v22.86,30.48
  Route15 0.152: v5.4,21.91 5.4,21.65 5.65,21.4 6.29,21.4 6.48,21.59 11.43,21.59 12.7,22.86 17.65,22.86 21.59,26.8 21.59,29.34 22.73,30.48 v22.86,30.48
!CS3  (via drill 0.2)
  Top 0.152: U40.2 10.54,10.41 v10.48,10.48 | PC_W.38 24.23,30.38 v23.49,31.11
  Route15 0.152: v10.48,10.48 10.67,10.48 10.98,10.79 10.98,11.37 10.79,11.56 10.79,14.99 13.78,17.97 13.78,20 15.68,21.91 17.72,21.91 21.53,25.72 23.05,25.72 23.81,26.48 23.81,30.8 v23.49,31.11
!CS4  (via drill 0.2)
  Top 0.152: U43.2 69.47,41.02 v69.53,40.96 | PC_C.36 48.6,32.05 48.26,32.38 v47.62,32.38
  Route15 0.152: v69.53,40.96 69.34,40.96 69.02,40.64 69.02,40.07 69.22,39.88 69.22,35.31 67.56,33.66 65.53,33.66 64.26,34.92 59.69,34.92 57.47,32.7 54.1,32.7 53.47,33.34 48.89,33.34 47.94,32.38 v47.62,32.38
!CS5  (via drill 0.2)
  Top 0.152: U47.2 58.03,41.02 v58.1,40.96 | PC_C.37 47.33,30.77 46.99,31.11 v46.99,31.75
  Route15 0.152: v58.1,40.96 57.85,40.96 57.59,40.7 57.59,40.07 57.78,39.88 57.78,34.54 56.58,33.34 54.42,33.34 53.78,33.97 48.58,33.97 47.94,33.34 47.43,33.34 46.67,32.58 46.67,32.07 v46.99,31.75
!CS6  (via drill 0.2)
  Top 0.152: U44.2 46.6,39.75 v46.67,39.69 | PC_C.38 47.09,30.38 v46.35,31.11
  Route15 0.152: v46.35,31.11 45.72,31.75 45.72,33.15 46.35,33.78 46.35,38.61 46.16,38.8 46.16,39.37 46.48,39.69 v46.67,39.69
!CS7  (via drill 0.2)
  Top 0.152: U48.2 35.17,37.85 v35.24,37.78 | PC_C.39 46.86,29.97 46.35,30.48 v45.72,30.48
  Route15 0.152: v35.24,37.78 35.05,37.78 34.73,37.47 34.73,36.89 34.92,36.7 34.92,33.27 36.45,31.75 44.45,31.75 v45.72,30.48
!CS8  (via drill 0.2)
  Top 0.152: U51.2 32.13,16.12 v32.07,16.19 | PC_C.12 53,25.11 53.34,24.77 v53.97,24.77
  Route15 0.152: v32.07,16.19 32.26,16.19 32.58,16.51 32.58,17.08 32.38,17.27 32.38,21.59 34.29,23.49 36.07,23.49 37.34,22.23 41.91,22.23 44.45,24.77 47.24,24.77 48.2,23.81 53.15,23.81 53.97,24.64 v53.97,24.77
!CS9  (via drill 0.2)
  Top 0.152: U55.2 43.56,16.12 v43.5,16.19 | PC_C.13 54.27,26.38 54.61,26.04 v54.61,25.4
  Route15 0.152: v43.5,16.19 43.69,16.19 44,16.51 44,17.08 43.81,17.27 43.81,22.61 45.34,24.13 46.86,24.13 47.81,23.18 53.53,23.18 54.93,24.57 54.93,25.08 v54.61,25.4
!CS10  (via drill 0.2)
  Top 0.152: U52.2 54.99,17.39 v54.93,17.46 | PC_C.14 54.5,26.77 v55.24,26.04
  Route15 0.152: v54.93,17.46 55.12,17.46 55.44,17.78 55.44,18.35 55.24,18.54 55.24,23.37 55.88,24 55.88,25.4 v55.24,26.04
!CS11  (via drill 0.2, 0.25)
  Top 0.152: U56.2 66.42,19.3 v66.36,19.37 | PC_C.15 54.74,27.18 55.24,26.67 v55.88,26.67
  Route15 0.152: v66.36,19.37 66.55,19.37 66.87,19.68 66.87,20.26 66.67,20.45 66.67,23.88 65.15,25.4 57.15,25.4 v55.88,26.67
!RESET  (via drill 0.2)
  Top 0.152: IOC.28 90.44,37.42 v90.17,37.15
  Bottom 0.152: U5.11 89.42,40.26 88.84,40.26 88.58,40 88.58,39.37 90.17,37.78 v90.17,37.15
A_!RST  (via drill 0.2)
  Top 0.152: PB-NW.1 20.03,44.8 17.33,42.1 v17.14,42.1 | PC_W.25 30.14,32.05 v30.48,32.38
  Route2 0.152: v17.14,42.1 17.27,42.1 18.1,41.27 25.4,41.27 31.43,35.24 31.43,33.34 v30.48,32.38
A_SCL  (via drill 0.2)
  Top 0.152: U2.3 23.32,36.83 v22.22,36.83 | PB-NW.2 23.81,44.8 23.3,44.29 23.3,39.5 v23.18,39.37
  Route15 0.152: v23.18,39.37 23.18,37.02 22.99,36.83 v22.22,36.83
  Bottom 0.152: v22.22,36.83 22.07,36.68 RN1.1
A_SDA  (via drill 0.2)
  Top 0.152: U2.4 22.34,36.31 v22.22,36.2 | PB-NW.4 23.94,44.3 23.69,44.04 23.69,39.5 v23.81,39.37
  Route15 0.152: v23.81,39.37 23.49,39.05 23.49,36.83 23.18,36.51 22.54,36.51 v22.22,36.2
  Bottom 0.152: v22.22,36.2 22.16,36.13 RN1.2
ANY_IN  (via drill 0.2, 0.25)
  Top 0.305: v87.95,28.57 U17.3 U17.4
  Route15 0.305: 87.82,28.57 86.81,28.57 | 86.61,28.57 85.47,28.57 | 84.65,28.57 83.63,28.57
  Route15 0.61: v87.95,28.57 87.82,28.57 | 86.81,28.57 86.61,28.57 | 85.47,28.57 84.65,28.57 | 83.63,28.57 v81.6,28.57
  Bottom 0.254: U20.8 80.96,27.81 81.22,28.07 80.96,28.32 U20.7
  Bottom 0.406: 81.22,28.07 81.6,28.07 v81.6,28.57 C34.1
B_!RST  (via drill 0.2)
  Top 0.152: PB-SE.1 81.57,12.36 83.82,14.6 v84.45,14.6 | v79.06,24.77 79.06,25.4 78.08,26.38 PC_E.13
  Route2 0.152: v84.45,14.6 83.82,14.6 80.64,17.78 80.64,22.61 79.06,24.19 v79.06,24.77
B_SCL  (via drill 0.2)
  Top 0.152: v79.38,20.32 78.28,20.32 U3.3 | PB-SE.2 77.79,12.36 78.3,12.86 78.3,17.65 v78.42,17.78
  Route15 0.152: v78.42,17.78 78.42,20.13 78.61,20.32 v79.38,20.32
  Bottom 0.152: v79.38,20.32 79.53,20.47 RN2.1
B_SDA  (via drill 0.2)
  Top 0.152: U3.4 79.26,20.84 v79.38,20.95 | PB-SE.4 77.66,12.85 77.91,13.11 77.91,17.65 v77.79,17.78
  Route15 0.152: v77.79,17.78 78.1,18.1 78.1,20.32 78.42,20.64 79.06,20.64 v79.38,20.95
  Bottom 0.152: v79.38,20.95 79.44,21.02 RN2.2
BANK13_00_N  (via drill 0.2)
  Top 0.152: BETA.89 v35.2,51.44
  Bottom 0.152: ZED.89 v35.2,51.44
BANK13_00_P  (via drill 0.2)
  Top 0.152: BETA.87 v36,51.44
  Bottom 0.152: ZED.87 v36,51.44
BANK13_01_N  (via drill 0.2)
  Top 0.152: BETA.90 v35.2,50.16
  Bottom 0.152: ZED.90 v35.2,50.16
BANK13_01_P  (via drill 0.2)
  Top 0.152: BETA.88 v36,50.16
  Bottom 0.152: ZED.88 v36,50.16
BANK13_02_N  (via drill 0.2)
  Top 0.152: BETA.93 v33.6,51.44
  Bottom 0.152: ZED.93 v33.6,51.44
BANK13_02_P  (via drill 0.2)
  Top 0.152: BETA.91 v34.4,51.44
  Bottom 0.152: ZED.91 v34.4,51.44
BANK13_03_N  (via drill 0.2)
  Top 0.152: BETA.94 v33.6,50.16
  Bottom 0.152: ZED.94 v33.6,50.16
BANK13_03_P  (via drill 0.2)
  Top 0.152: BETA.92 v34.4,50.16
  Bottom 0.152: ZED.92 v34.4,50.16
BANK13_04_N  (via drill 0.2)
  Top 0.152: BETA.195 v32.8,6.98
  Bottom 0.152: ZED.195 v32.8,6.98
BANK13_04_P  (via drill 0.2)
  Top 0.152: BETA.193 v33.6,6.98
  Bottom 0.152: ZED.193 v33.6,6.98
BANK13_05_N  (via drill 0.2)
  Top 0.152: BETA.196 v32.8,5.71
  Bottom 0.152: ZED.196 v32.8,5.71
BANK13_05_P  (via drill 0.2)
  Top 0.152: BETA.194 v33.6,5.71
  Bottom 0.152: ZED.194 v33.6,5.71
BANK13_06_N  (via drill 0.2)
  Top 0.152: BETA.199 v31.2,6.98
  Bottom 0.152: ZED.199 v31.2,6.98
BANK13_06_P  (via drill 0.2)
  Top 0.152: BETA.197 v32,6.98
  Bottom 0.152: ZED.197 v32,6.98
BANK13_SE_0  (via drill 0.2)
  Top 0.203: BETA.200 v31.2,5.71
  Bottom 0.203: ZED.200 v31.2,5.71
BETA_5V  (via drill 0.2, 0.25, 0.33, 0.41)
  Top 0.152: U15.6 97.92,32.13 98.42,32.64 98.42,33.34 v98.74,33.66 | U35.8 4.51,46.74 v4.45,46.67 | C60.1 v4.45,42.55 | C66.1 v9.52,42.55 | U37.10 9.16,45.99 v8.89,45.72 | U39.8 5.33,29.28 v5.4,29.21 | C72.1 v9.52,29.21 | C78.1 v9.52,34.29 | U41.10 6.08,33.92 v6.35,33.66 | U36.8 5.33,19.12 v5.4,19.05 | C61.1 v9.52,19.05 | C67.1 v9.52,24.13 | U38.10 6.08,23.77 v6.35,23.49 | U40.8 13.27,10.41 v13.33,10.48 | C73.1 v13.33,14.6 | C79.1 v8.25,14.6 | U42.10 8.62,11.16 v8.89,11.43 | U43.8 66.74,41.02 v66.67,40.96 | C84.1 v66.67,36.83 | C90.1 v71.75,36.83 | U45.10 71.39,40.27 v71.12,40 | U47.8 55.31,41.02 v55.24,40.96 | C96.1 v55.24,36.83 | C102.1 v60.32,36.83 | U49.10 59.96,40.27 v59.69,40 | U44.8 43.88,39.75 v43.81,39.69 | C85.1 v43.81,35.56 | C91.1 v48.89,35.56 | U46.10 48.53,39 v48.26,38.73 | U48.8 32.45,37.85 v32.38,37.78 | C97.1 v32.38,33.66 | C103.1 v37.46,33.66 | U50.10 37.1,37.1 v36.83,36.83 | U50.1 41,37.1 v41.27,36.83 | U50.9 36.96,37.6 v36.83,37.47 | U46.9 48.39,39.5 v48.26,39.37 | U49.1 63.86,40.27 v64.13,40 | U51.8 34.86,16.12 v34.92,16.19 | C108.1 v34.92,20.32 | C114.1 v29.84,20.32 | U53.10 30.21,16.88 v30.48,17.14 | U55.8 46.29,16.12 v46.35,16.19 | C120.1 v46.35,20.32 | C126.1 v41.27,20.32 | U57.10 41.64,16.88 v41.91,17.14 | U52.8 57.72,17.39 v57.78,17.46 | C109.1 v57.78,21.59 | C115.1 v52.7,21.59 | U54.10 53.07,18.14 v53.34,18.41 | U56.8 69.15,19.3 v69.22,19.37 | C121.1 v69.22,23.49 | C127.1 v64.13,23.49 | U58.10 64.5,20.05 v64.77,20.32 | U58.1 60.59,20.05 v60.32,20.32 | U58.9 64.63,19.55 v64.77,19.68 | U54.9 53.2,17.64 v53.34,17.78 | U57.1 37.73,16.88 v37.46,17.14 | U12.3 31.62,43.18 arc90 30.29,41.85 v30.29,38.73 | U41.1 6.08,37.83 v6.35,38.1 | U38.9 5.58,23.63 v5.71,23.49
  Top 0.152: U42.1 4.71,11.16 v4.45,11.43 | U42.9 8.75,10.66 v8.89,10.79 | U11.3 69.98,13.97 arc90 71.31,15.3 v71.31,18.41 | U28.3 84.45,23.53 v84.45,23.81 | U27.3 17.14,33.62 v17.14,33.34
  Top 0.203: IO_E.8 59.57,30.59 v58.74,31.43 | IO_W.8 19.48,27.82 v19.68,27.62 | IO_C.8 42.02,26.55 v42.86,25.72
  Top 0.305: U14.D1 86.68,30.8
  Top 0.33: U14.6 87.3,30.99 U14.D1
  Top 0.457: U12.1 C13.1 31.62,44.18 arc90 29.46,42.02 v29.46,39.37 | U12.5 C14.1 31.5,42.18 arc90 31.11,41.8 v31.11,39.37 | U11.5 C7.1 69.98,14.97 arc90 70.48,15.47 v70.48,17.78 | U11.1 C8.1 69.98,12.97 arc90 72.14,15.13 v72.14,17.78
  Top 1.219: v84.14,31.11 v84.14,30.16 | v84.14,30.16 v84.14,29.21 v84.14,27.94 | 86.68,30.8 84.14,30.8 v84.14,30.16
  Route2 0.152: v84.14,31.11 84.45,30.8 87,30.8 87.82,29.97 90.3,29.97 92.71,32.38 97.79,32.38 98.74,33.34 v98.74,33.66
  Route15 0.61: v84.45,23.81 84.59,23.68 arc45 85.04,23.49 v88.58,23.49
  Bottom 0.152: RN3.3 14.6,20.99 | RN3.4 14.6,20.29 | RN12.3 56.8,32.77 | RN12.4 57.5,32.77 | RN9.4 44.1,24.38 | RN9.3 44.8,24.38 | RN10.4 20.57,29.24 | RN10.3 20.57,28.54 | RN8.4 20.57,27.34 | RN8.3 20.57,26.64 | RN5.3 95.22,21.24 95.57,21.59 95.92,21.24 RN5.4 | RN4.3 22.64,24.13 | RN4.4 23.34,24.13 | RN6.4 78.26,33.02 | RN6.3 78.96,33.02 | U23.10 88.85,21.32 88.58,21.59 88.58,22.54
  Bottom 0.406: UA.4 UA.3 | UB.4 UB.3 | UC.4 UC.3 | UD.4 UD.3 | UE.4 UE.3 | UF.4 UF.3 | UG.4 UG.3 | UH.4 UH.3 | U_I.4 U_I.3 | U_J.4 U_J.3 | U_K.4 U_K.3 | U_L.4 U_L.3 | U_P.4 U_P.3 | U_O.4 U_O.3 | U_N.4 U_N.3 | U_M.4 U_M.3 | U_Q.4 U_Q.3 | U_R.4 U_R.3 | U_S.4 U_S.3 | U_T.4 U_T.3 | U_X.4 U_X.3 | U_W.4 U_W.3 | U_V.4 U_V.3 | U_U.4 U_U.3 | 88.58,22.54 95.57,22.54 | 95.57,22.54 95.57,21.59 | 95.57,22.54 97.47,22.54 U59.4
  Bottom 0.508: UA.4 12.59,41.27 C62.1 13.33,41.27 | UB.4 7.51,41.27 C68.1 8.25,41.27 | UC.4 10.79,37.36 C74.1 10.79,38.1 | UD.4 10.79,32.28 C80.1 10.79,33.02 | UE.4 10.79,27.2 C64.1 10.79,27.94 | UF.4 10.79,22.12 C70.1 10.79,22.86 | UG.4 5.19,15.88 C76.1 4.45,15.88 | UH.4 10.27,15.88 C82.1 9.52,15.88 | U_I.4 74.82,35.56 C86.1 75.56,35.56 | U_J.4 69.74,35.56 C92.1 70.48,35.56 | U_K.4 63.39,35.56 C98.1 64.13,35.56 | U_L.4 58.31,35.56 C104.1 59.05,35.56 | U_P.4 35.45,32.38 C106.1 36.19,32.38 | U_O.4 40.53,32.38 C100.1 41.27,32.38 | U_N.4 46.88,34.29 C94.1 47.62,34.29 | U_M.4 51.96,34.29 C88.1 52.7,34.29 | U_Q.4 26.78,21.59 C110.1 26.03,21.59 | U_R.4 31.86,21.59 C116.1 31.11,21.59 | U_S.4 38.21,21.59 C122.1 37.46,21.59 | U_T.4 43.29,21.59 C128.1 42.54,21.59 | U_X.4 66.15,24.77 C130.1 65.41,24.77 | U_W.4 61.07,24.77 C124.1 60.32,24.77 | U_V.4 54.72,22.86 C118.1 53.97,22.86 | U_U.4 49.64,22.86 C112.1 48.89,22.86 | v88.58,23.49 88.58,22.54
  pour Bottom (rank 3): 85.09,0 0,0 0,57.15 85.09,57.15
BETA_!FAULT
  Top 0.152: U15.7 97.85,32.63 98.11,32.89 98.11,34.29 97.47,34.92 88.9,34.92 87.63,33.66 78.23,33.66 77.47,32.89 77.47,31.11 77.13,30.77 PC_E.24
BETA_!SHDN
  Top 0.152: U15.8 97.66,33.13 97.79,33.26 97.79,34.1 97.28,34.61 89.09,34.61 87.82,33.34 78.42,33.34 77.79,32.7 77.79,30.8 77.36,30.38 PC_E.23
BETA_GATE  (via drill 0.2)
  Top 0.152: U14.2 87.95,29.53 v88.27,29.21 | v87.63,32.38 87.95,32.07 U14.5 | U15.5 97.98,31.63 98.74,32.4 98.74,33.02 v99.38,33.66
  Route2 0.152: v87.63,32.38 87.95,33.02 89.85,34.92 98.42,34.92 99.38,33.97 v99.38,33.66
  Route15 0.152: v87.63,32.38 87.63,31.11 88.27,30.48 v88.27,29.21
BETA_IN  (via drill 0.2)
  Top 0.152: R11.1 92.07,31.43 91.44,30.8 | U15.4 94.41,31.63 93.66,32.38 93.66,33.02 v93.03,33.66 | U17.2 92.41,29.22 92.71,29.53
  Top 0.305: v89.22,30.8 U14.D2 88.6,30.61 | 93.98,29.53 R10.2
  Top 0.33: U14.3 88.6,30.61
  Top 1.118: v89.22,30.8 91.44,30.8 92.71,29.53 93.98,29.53
  Route2 0.152: v93.03,33.66 90.17,30.8 v89.22,30.8
  Route15 0.152: v89.22,30.8 91.19,30.8 92.07,29.91 92.07,21.2 92.46,20.82 v93.03,20.82
  Bottom 0.152: U23.2 v93.03,20.82
BETA_OV  (via drill 0.2)
  Top 0.152: U15.2 94.55,32.63 94.3,32.89 v94.3,33.66 | R13.1 90.41,32.94 v90.49,33.02 90.57,32.94 R12.2
  Route2 0.152: v90.49,33.02 91.12,33.02 92.39,34.29 93.98,34.29 94.3,33.97 v94.3,33.66
BETA_SUP  (via drill 0.2, 0.33)
  Top 0.305: R10.1 95.88,29.53
  Top 1.118: 95.88,29.53 96.92,29.53 v97.47,30.07
  Top 1.219: v99.38,30.07 v98.74,30.07 v97.47,30.07
  Route15 0.152: v97.47,30.07 95.5,30.07 94.61,29.19 94.61,21.57 94.36,21.32 v93.98,21.32
  Bottom 0.152: U23.1 v93.98,21.32
  Bottom 0.813: X1.4 X1.4A v97.47,30.07
  Bottom 1.016: v97.47,30.07 v98.11,30.07 v98.74,30.07 v99.38,30.07
BETA_UV  (via drill 0.2)
  Top 0.152: R11.2 R12.1 90.57,33.74 v90.49,33.66 | U15.3 94.49,32.13 93.98,32.64 93.98,33.34 v93.66,33.66
  Route15 0.152: v93.66,33.66 93.66,33.97 93.34,34.29 90.81,34.29 90.49,33.97 v90.49,33.66
BTN  (via drill 0.2)
  Top 0.152: PC_W.26 29.74,32.41 30.48,33.15 v30.48,33.66
  Route2 0.152: v30.48,33.66 30.48,35.69 25.84,40.32 17.72,40.32 16.19,41.85 16.19,51.94 15.56,52.58 v13.33,52.58
  Bottom 0.152: S1.2 13.33,54.32 v13.33,52.58
CBUS2  (via drill 0.2)
  Top 0.152: IOC.36 93.64,37.8 93.98,37.47 94.3,37.47 94.61,37.78 v94.61,38.1
  Bottom 0.152: U5.7 91.94,38.55 92.39,38.1 v94.61,38.1
CC_!MCLR  (via drill 0.2)
  Top 0.152: IOC.20 87.98,40.67 v87.31,40
  Route15 0.152: v87.31,44.77 87.95,44.77 88.27,44.45 88.27,40.32 87.95,40 v87.31,40
  Bottom 0.152: U5.16 90.44,44.05 89.72,44.77 v87.31,44.77
CC_JX1
  Top 0.152: U8.3 95.43,47.17 94.93,46.67 91.25,46.67 90.84,46.26 IOC.8
CC_PCLK  (via drill 0.2)
  Top 0.152: IOC.18 87.51,41.48 v87.31,41.27
  Bottom 0.152: U5.15 88.31,42.27 v87.31,41.27
CC_PDAT  (via drill 0.2)
  Top 0.152: IOC.19 87.75,41.08 v87.31,40.64
  Bottom 0.152: U5.14 88.45,41.77 v87.31,40.64
CC_SE_0  (via drill 0.2)
  Top 0.152: IOC.47 95.14,43.08 v95.57,43.5
  Route2 0.152: v95.57,43.5 97.73,43.5 100.33,40.89 100.33,9.08 99.06,7.81 91.63,7.81 90.49,6.67 v89.85,6.67
  Bottom 0.152: U1.6 89.71,6.52 v89.85,6.67
CC_SE_1  (via drill 0.2)
  Top 0.152: IOC.48 94.91,43.48 v95.57,44.13
  Route2 0.152: v95.57,44.13 97.73,44.13 100.77,41.08 100.77,8.95 99.25,7.43 91.82,7.43 90.42,6.03 v89.85,6.03
  Bottom 0.152: U1.7 89.71,6.18 v89.85,6.03
CD  (via drill 0.2)
  Top 0.203: v88.58,12.7 87.63,12.7 | SD1.CD1 87.38,9.62 87.63,9.87 87.63,12.7 | SD1.CD2 87.38,15.62 87.63,15.37 87.63,12.7
  Bottom 0.203: U4.1 90.68,12.51 90.49,12.7 v88.58,12.7
CD'  (via drill 0.2)
  Top 0.152: IOC.32 92.04,36.16 v91.76,35.88
  Route2 0.152: v91.76,35.88 91.44,35.56 89.53,35.56 86.36,32.38 83.5,32.38 82.87,31.75 82.87,27.94 88.14,22.67 89.34,22.67 90.68,21.34 v90.68,16.51
  Route15 0.152: v90.49,4.13 90.68,4.32 v90.68,16.51
  Bottom 0.203: U4.16 90.68,4.32 v90.49,4.13
CLK  (via drill 0.2)
  Top 0.203: SD1.5 v93.98,12.22
  Bottom 0.203: U4.5 92.28,11.84 92.66,12.22 v93.98,12.22
CMD  (via drill 0.2)
  Top 0.203: SD1.3 v93.98,14.42
  Bottom 0.203: R3.2 v93.98,14.42 92.38,14.42 91.87,13.91 U4.4
CNW_EN  (via drill 0.2)
  Top 0.152: PC_W.22 31.88,29.97 v32.7,30.8
  Route2 0.152: v17.14,35.88 17.14,35.81 20.57,32.38 23.11,32.38 24.07,33.34 25.72,33.34 27.62,31.43 29.15,31.43 29.78,30.8 v32.7,30.8
  Bottom 0.152: CNW.3 17.14,34.72 v17.14,35.88
CNW_PG
  Bottom 0.152: C55.1 17.16,38.42 CNW.4 17.14,37.05
CSE_EN  (via drill 0.2)
  Top 0.152: PC_E.15 78.3,27.18 80.07,25.4 v80.33,25.4
  Route2 0.152: v84.45,21.27 84.45,21.84 81.22,25.08 80.64,25.08 v80.33,25.4
  Bottom 0.152: 84.45,22.43 CSE.3 84.45,22.45 v84.45,21.27
CSE_PG
  Bottom 0.152: CSE.4 84.44,18.73 C58.1
CSO_NE_V  (via drill 0.3)
  Top 0.457: 67.49,56.49 67.62,56.52 arc-90 68,56.13 BETA.7
  Top 0.813: 67.49,56.49 16.85,56.49 arc90 14.88,54.52 14.88,42.01 arc-90 13.87,41 v3.49,41 v2.86,41 v2.22,41
  Bottom 0.61: 2.25,30.01 FB9.2
  Bottom 0.813: v3.49,41 v2.86,41 v2.22,41 arc90 0.66,39.43 0.66,30.64 arc90 1.29,30.01 2.25,30.01
CSO_NW_V
  Bottom 0.61: PWR-NW.6 20.95,46.14 arc90 24.76,42.33 43.23,42.33 arc-45 43.68,42.14 43.73,42.1 arc45 44.18,41.91 FB14.2
CSO_SE_V
  Bottom 0.61: PWR-SE.6 80.64,11.01 arc90 76.83,14.82 58.37,14.82 arc-45 57.92,15.01 57.87,15.05 arc45 57.42,15.24 FB22.2
CSO_SW_V  (via drill 0.3)
  Top 0.457: 65.89,0.66 66.02,0.63 arc90 66.4,1.02 BETA.112
  Top 0.813: 65.89,0.66 16.85,0.66 arc-90 14.88,2.63 14.88,15.14 arc90 13.87,16.15 v3.49,16.15 v2.86,16.15 v2.22,16.15
  Bottom 0.61: 2.25,24.93 FB4.2
  Bottom 0.813: v3.49,16.15 v2.86,16.15 v2.22,16.15 arc-90 0.66,17.72 0.66,24.29 arc-90 1.29,24.93 2.25,24.93
D0  (via drill 0.2)
  Top 0.152: IOC.5 92.04,45.69 v92.07,45.72
  Bottom 0.152: U5.17 90.94,44.08 92.07,45.21 v92.07,45.72
D1  (via drill 0.2)
  Top 0.152: IOC.45 95.3,42.27 v95.57,42.55
  Bottom 0.152: U5.1 94.47,42.27 94.74,42.55 v95.57,42.55
D2  (via drill 0.2)
  Top 0.152: IOC.3 92.84,45.22 v93.34,45.72
  Bottom 0.152: U5.19 91.94,44.06 93.34,45.47 v93.34,45.72
D3  (via drill 0.2)
  Top 0.152: IOC.2 93.24,44.98 v93.98,45.72
  Route2 0.152: v95.25,38.1 95.25,37.47 94.93,37.15 93.66,37.15 93.34,37.47 93.34,44.45 93.98,45.09 v93.98,45.72
  Bottom 0.152: U5.6 92.44,38.69 92.71,38.42 94.23,38.42 94.36,38.55 94.93,38.55 95.25,38.23 v95.25,38.1
D4  (via drill 0.2)
  Top 0.152: IOC.4 92.44,45.45 v92.71,45.72
  Bottom 0.152: U5.18 91.44,44.07 92.71,45.34 v92.71,45.72
D5  (via drill 0.2)
  Top 0.152: IOC.43 95.37,41.48 v95.57,41.27
  Bottom 0.152: U5.4 94.5,40.77 95,41.27 v95.57,41.27
D6  (via drill 0.2)
  Top 0.152: IOC.42 95.13,41.08 v95.57,40.64
  Bottom 0.152: U5.5 94.5,40.27 94.87,40.64 v95.57,40.64
D7  (via drill 0.2)
  Top 0.152: IOC.44 95.53,41.88 v95.57,41.91
  Bottom 0.152: U5.2 94.48,41.77 94.61,41.91 v95.57,41.91
DAT0  (via drill 0.2)
  Top 0.203: SD1.7 v93.98,10.02
  Bottom 0.203: R4.2 v93.98,10.02 92.94,10.02 92.69,9.77 U4.6
DAT1  (via drill 0.2)
  Top 0.203: SD1.8 v93.98,8.92
  Bottom 0.203: R5.2 v93.98,8.92 93.19,8.92 93.07,8.79 U4.7
DAT2  (via drill 0.2)
  Top 0.203: SD1.1 v93.98,16.62
  Bottom 0.203: R6.2 v93.98,16.62 91.85,16.62 91.08,15.86 U4.2
DAT3  (via drill 0.2)
  Top 0.203: SD1.2 v93.98,15.52
  Bottom 0.203: U4.3 91.47,14.88 92.1,15.52 v93.98,15.52
DM
  Bottom 0.203: U5.9 90.94,37.21 91.32,36.83 98.3,36.83 98.68,37.21 98.68,37.97 98.87,38.16 R7.2
DP
  Bottom 0.203: U5.8 91.44,37.4 91.57,37.27 98.04,37.27 98.17,37.4 98.17,37.97 97.98,38.16 R8.2
DXP_0_N  (via drill 0.2)
  Top 0.152: BETA.100 v31.2,50.16
  Bottom 0.152: ZED.100 v31.2,50.16
DXP_0_P  (via drill 0.2)
  Top 0.152: BETA.98 v32,50.16
  Bottom 0.152: ZED.98 v32,50.16
E_B_SCL  (via drill 0.2)
  Top 0.152: v79.38,22.23 78.28,22.23 U3.6 | PC_E.47 69.64,26.77 v69.22,26.35
  Route15 0.152: v79.38,22.23 78.74,22.23 74.93,26.04 69.6,26.04 69.28,26.35 v69.22,26.35
  Bottom 0.152: v79.38,22.23 79.53,22.07 RN2.4
E_B_SDA  (via drill 0.2)
  Top 0.152: U3.5 79.26,21.7 v79.38,21.59 | PC_E.48 70.19,26.38 69.53,25.72 v69.53,25.4
  Route15 0.152: v79.38,21.59 79.06,21.91 78.55,21.91 74.74,25.72 69.85,25.72 v69.53,25.4
  Bottom 0.152: RN2.3 79.44,21.52 v79.38,21.59
E_I2C_EN
  Top 0.152: 80.01,41.27 U29.2 80.01,36.7 79.18,35.88 74.36,35.88 71.46,32.98 PC_E.36
E_I2C_V  (via drill 0.25)
  Top 0.203: U29.6 79.51,45.9 v79.38,46.04
  Bottom 0.406: C38.1 v79.38,46.04 79.38,53.59 arc-90 79.76,53.97 PWR-NE.6
E_RC2
  Top 0.152: PC_E.40 69.1,29.57 68.92,29.76 R19.1
E_RF1  (via drill 0.2)
  Top 0.152: PC_E.37 70.19,30.77 69.85,31.11 v69.85,31.75
  Route2 0.152: v69.85,31.75 70.48,31.11 73.15,31.11 74.42,32.38
E_RF2  (via drill 0.2)